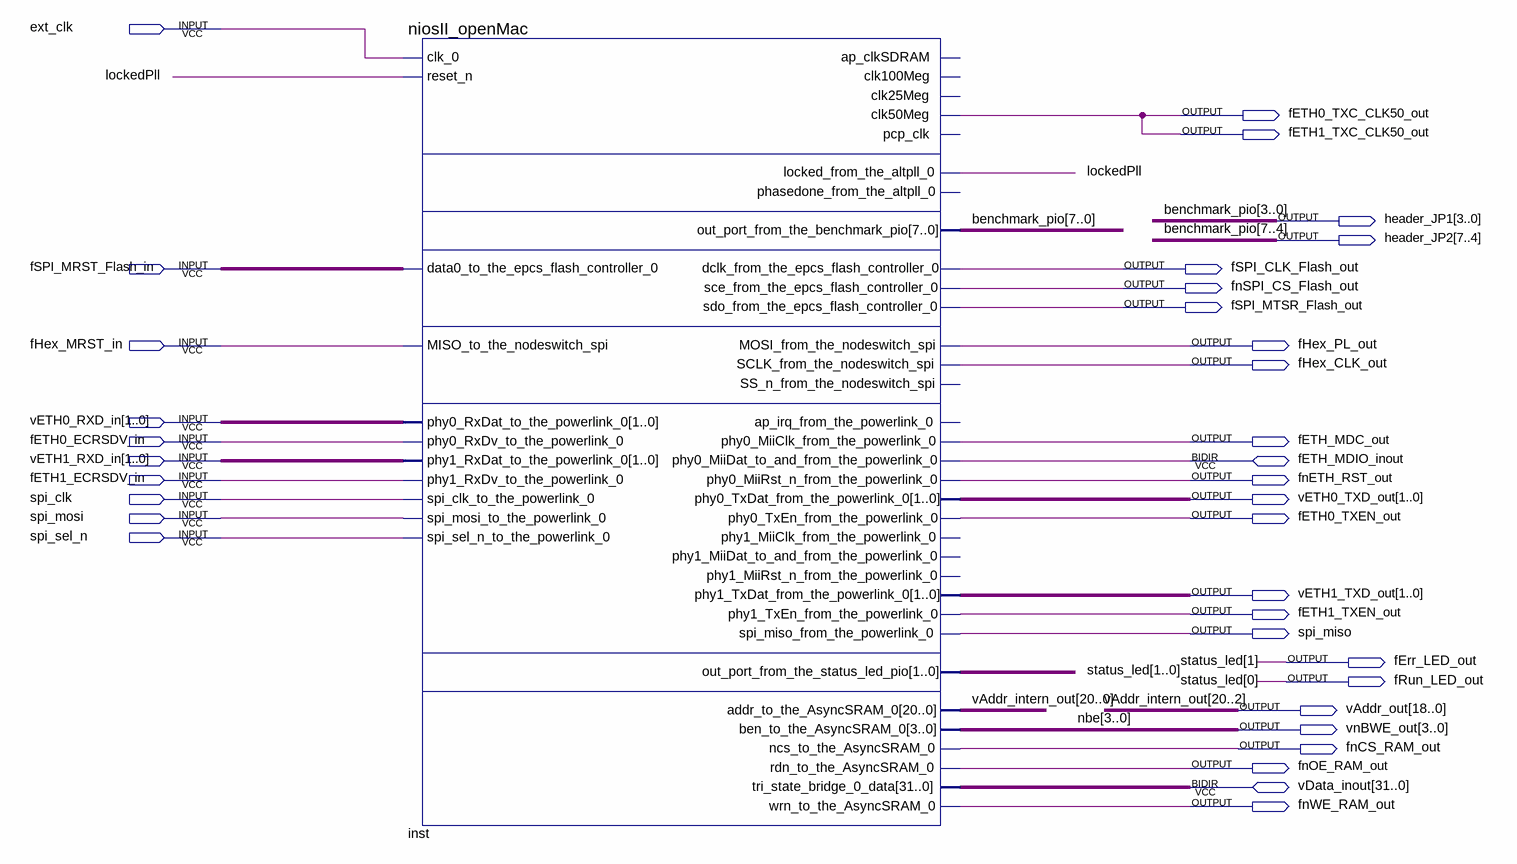
[diagram p0: schematic sheet]
// Quartus schematic nios_pll.bdf as structural Verilog: 1 symbols, 35 pins
module nios_pll (
  input  ext_clk,
  input  fSPI_MRST_Flash_in,
  input  fHex_MRST_in,
  input  [1:0] vETH0_RXD_in,
  input  fETH0_ECRSDV_in,
  input  [1:0] vETH1_RXD_in,
  input  fETH1_ECRSDV_in,
  input  spi_clk,
  input  spi_mosi,
  input  spi_sel_n,
  inout  fETH_MDIO_inout,
  inout  [31:0] vData_inout,
  output fETH0_TXC_CLK50_out,
  output fETH1_TXC_CLK50_out,
  output [3:0] header_JP1,
  output [7:4] header_JP2,
  output fSPI_CLK_Flash_out,
  output fnSPI_CS_Flash_out,
  output fSPI_MTSR_Flash_out,
  output fHex_PL_out,
  output fHex_CLK_out,
  output fETH_MDC_out,
  output fnETH_RST_out,
  output [1:0] vETH0_TXD_out,
  output fETH0_TXEN_out,
  output [1:0] vETH1_TXD_out,
  output fETH1_TXEN_out,
  output spi_miso,
  output fErr_LED_out,
  output fRun_LED_out,
  output [18:0] vAddr_out,
  output [3:0] vnBWE_out,
  output fnCS_RAM_out,
  output fnOE_RAM_out,
  output fnWE_RAM_out
);

  wire lockedPll;
  wire [1:0] vAddr_intern_out;

  niosII_openMac inst (
    .clk_0(ext_clk), .reset_n(lockedPll), .data0_to_the_epcs_flash_controller_0(fSPI_MRST_Flash_in),
    .MISO_to_the_nodeswitch_spi(fHex_MRST_in), .phy0_RxDat_to_the_powerlink_0(vETH0_RXD_in),
    .phy0_RxDv_to_the_powerlink_0(fETH0_ECRSDV_in), .phy1_RxDat_to_the_powerlink_0(vETH1_RXD_in),
    .phy1_RxDv_to_the_powerlink_0(fETH1_ECRSDV_in), .spi_clk_to_the_powerlink_0(spi_clk),
    .spi_mosi_to_the_powerlink_0(spi_mosi), .spi_sel_n_to_the_powerlink_0(spi_sel_n),
    .clk50Meg(fETH0_TXC_CLK50_out), .locked_from_the_altpll_0(lockedPll),
    .out_port_from_the_benchmark_pio({header_JP2, header_JP1}),
    .dclk_from_the_epcs_flash_controller_0(fSPI_CLK_Flash_out),
    .sce_from_the_epcs_flash_controller_0(fnSPI_CS_Flash_out),
    .sdo_from_the_epcs_flash_controller_0(fSPI_MTSR_Flash_out), .MOSI_from_the_nodeswitch_spi(fHex_PL_out),
    .SCLK_from_the_nodeswitch_spi(fHex_CLK_out), .phy0_MiiClk_from_the_powerlink_0(fETH_MDC_out),
    .phy0_MiiRst_n_from_the_powerlink_0(fnETH_RST_out), .phy0_TxDat_from_the_powerlink_0(vETH0_TXD_out),
    .phy0_TxEn_from_the_powerlink_0(fETH0_TXEN_out), .phy1_TxDat_from_the_powerlink_0(vETH1_TXD_out),
    .phy1_TxEn_from_the_powerlink_0(fETH1_TXEN_out), .spi_miso_from_the_powerlink_0(spi_miso),
    .out_port_from_the_status_led_pio({fErr_LED_out, fRun_LED_out}),
    .addr_to_the_AsyncSRAM_0({vAddr_out, vAddr_intern_out}), .ben_to_the_AsyncSRAM_0(vnBWE_out),
    .ncs_to_the_AsyncSRAM_0(fnCS_RAM_out), .rdn_to_the_AsyncSRAM_0(fnOE_RAM_out),
    .wrn_to_the_AsyncSRAM_0(fnWE_RAM_out), .phy0_MiiDat_to_and_from_the_powerlink_0(fETH_MDIO_inout),
    .tri_state_bridge_0_data(vData_inout));  // open: ap_clkSDRAM, clk100Meg, clk25Meg, pcp_clk, phasedone_from_the_altpll_0, SS_n_from_the_nodeswitch_spi, ap_irq_from_the_powerlink_0, phy1_MiiClk_from_the_powerlink_0, phy1_MiiRst_n_from_the_powerlink_0, phy1_MiiDat_to_and_from_the_powerlink_0

  assign fETH1_TXC_CLK50_out = fETH0_TXC_CLK50_out;

  // Other names for the same wires on the sheet: benchmark_pio[7:0] = {header_JP2, header_JP1}; nbe[3:0] = vnBWE_out;
  //   status_led[1:0] = {fErr_LED_out, fRun_LED_out}; vAddr_intern_out[20:2] = vAddr_out
endmodule
